# EAGLE design hello_world (EAGLE 6.5.0)
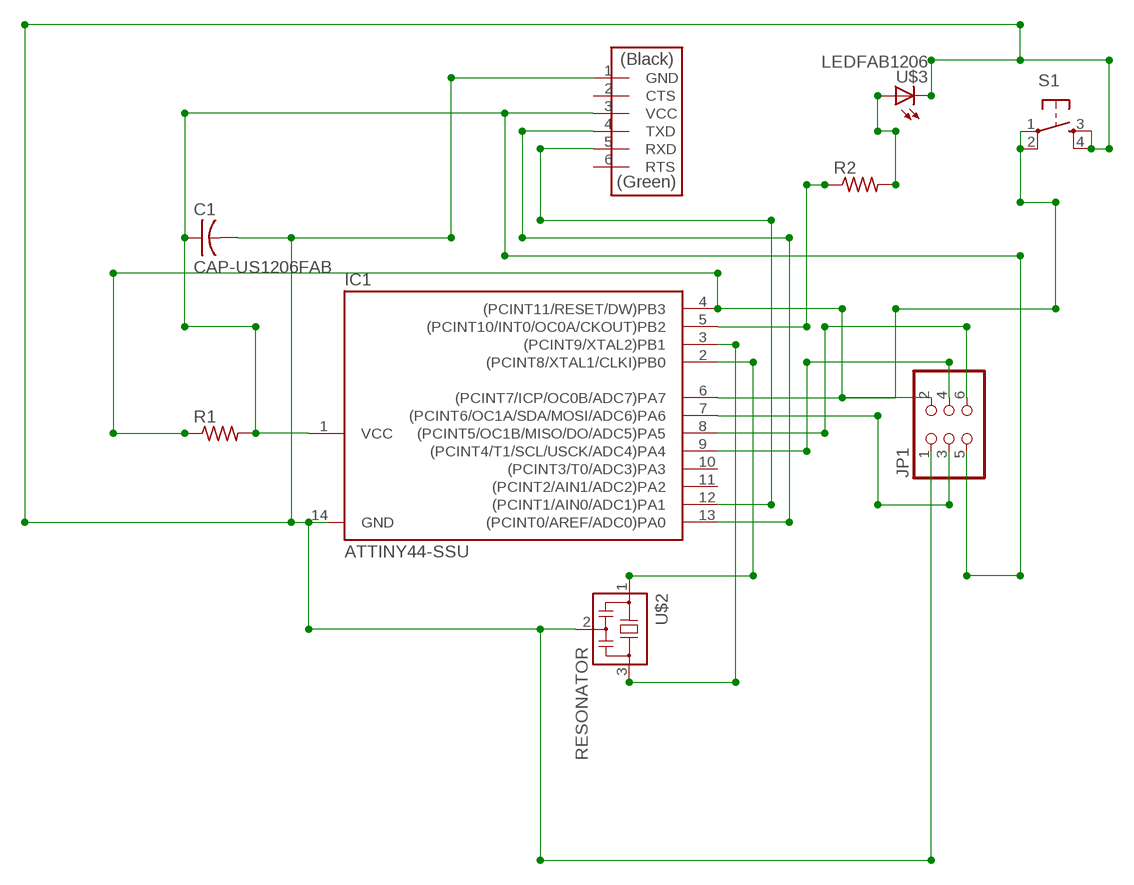
[diagram p0: schematic, sheet 1]

## Parts
C1  CAP-US1206FAB  [C1206FAB]
IC1  ATTINY44-SSU  [SOIC14]
JP1  PINHD-2X3-SMD  [2X03SMD]
R1  RES-US1206FAB  [R1206FAB]
R2  RES-US1206FAB  [R1206FAB]
S1  6MM_SWITCH6MM_SWITCH  [6MM_SWITCH]
U$1  FTDI-SMD-HEADER  [1X06SMD]
U$2  RESONATOR  [EFOBM]
U$3  LEDFAB1206  [LED1206FAB]

## Nets
N$1: C1.1 IC1.1(VCC) IC1.13((PCINT0/AREF/ADC0)PA0) JP1.5 R1.2 U$1.3(VCC) U$1.4(TXD)
N$2: IC1.9((PCINT4/T1/SCL/USCK/ADC4)PA4) JP1.4
N$3: IC1.7((PCINT6/OC1A/SDA/MOSI/ADC6)PA6) JP1.3
N$4: IC1.4((PCINT11/RESET/DW)PB3) JP1.2 R1.1
N$5: IC1.12((PCINT1/AIN0/ADC1)PA1) U$1.5(RXD)
N$6: IC1.2((PCINT8/XTAL1/CLKI)PB0) U$2.1
N$7: IC1.3((PCINT9/XTAL2)PB1) U$2.3
N$8: C1.2 IC1.14(GND) JP1.1 U$1.1(GND) U$2.2
N$9: IC1.8((PCINT5/OC1B/MISO/DO/ADC5)PA5) JP1.6
N$10: IC1.5((PCINT10/INT0/OC0A/CKOUT)PB2) R2.1
N$11: IC1.6((PCINT7/ICP/OC0B/ADC7)PA7) S1.1(P) S1.2(P1)
N$12: R2.2 U$3.1(A)
N$13: S1.3(S) S1.4(S1) U$3.2(C)
Unconnected: IC1.10((PCINT3/T0/ADC3)PA3) IC1.11((PCINT2/AIN1/ADC2)PA2) U$1.2(CTS) U$1.6(RTS)

## Library data of the parts
C1 = fab:CAP-US
IC1 = fab:ATTINY44
JP1 = fab:PINHD-2X3-SMD: PIN HEADER
R1 R2 = fab:RES-US: Resistor (US Symbol) Variants with postfix FAB are widened to allow the routing of internal traces
S1 = fab:6MM_SWITCH: OMRON SWITCH
U$1 = fab:FTDI-SMD-HEADER
U$2 = fab:RESONATOR
U$3 = fab:LED: LED

## Net classes
0 default: clearance 0.205 mm

## Board
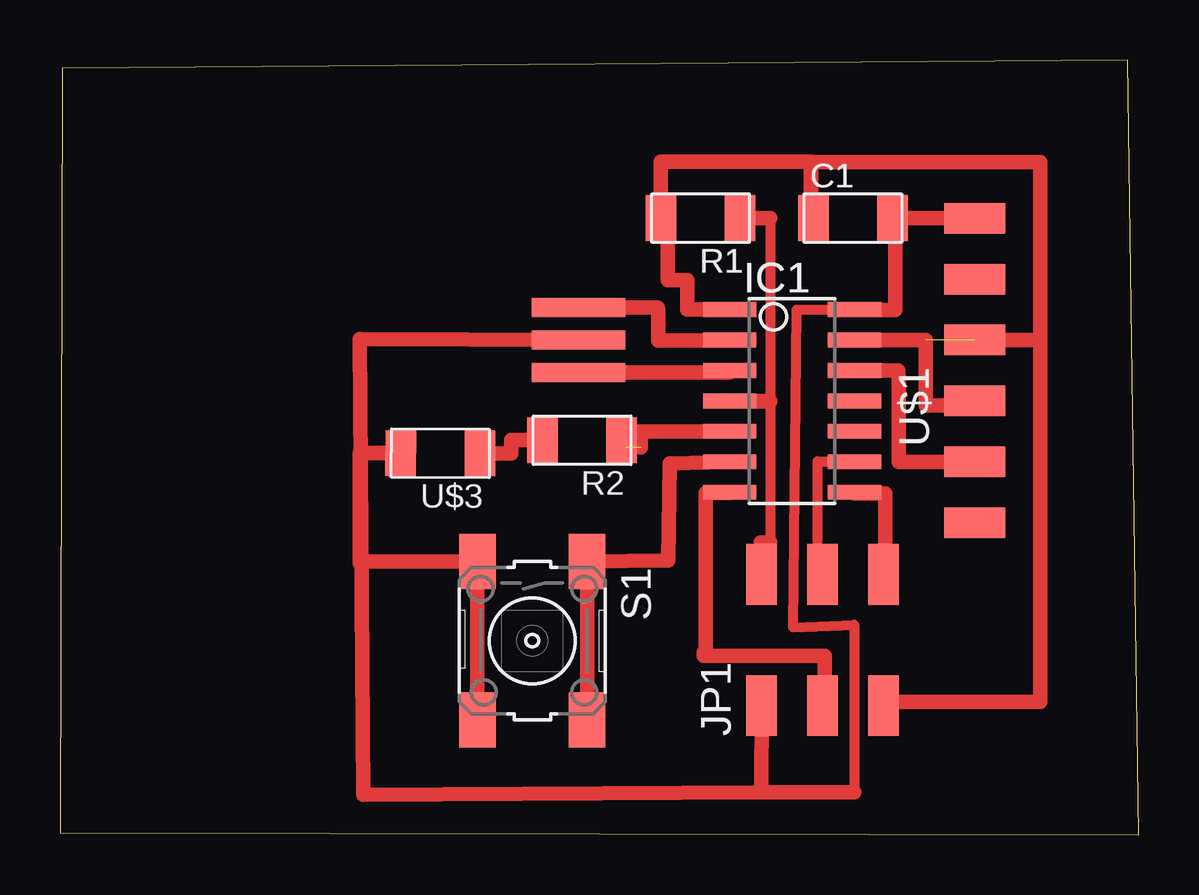
[diagram p1: board, top side]

Size 44.95 x 32.3 mm. Coordinates in mm from the lower left corner, seen from the top.
Outline: 0,0.08 44.95,0 44.48,32.3 0.1,31.95 0,0.08
Copper layers (1*16): Top 0.035mm / dielectric 1.5mm / Bottom 0.035mm
Design rules "Hello World Schemadic": minimum track width 10mil, minimum drill 24mil, track to track 0.205mm, track to pad 0.205mm, pad to pad 0.205mm, via to via 0.205mm, smd to smd 8mil, copper to edge 40mil, drill to drill 8mil, minimum pad ring 10mil, minimum via ring 8mil, stop-mask expansion 4mil, vias tented up to drill 0mil, thermal gap 10mil

### Footprints (pad centres in the part's own frame; a part is rotated, then mirrored left to right if it is on the bottom)
C1206FAB = smd 1.27 x 1.905: 1 -1.651,0; 2 1.651,0
SOIC14 = smd 0.61 x 2.21: 1 -3.81,-2.603; 2 -2.54,-2.603; 3 -1.27,-2.603; 4 0,-2.603; 5 1.27,-2.603; 6 2.54,-2.603; 7 3.81,-2.603; 8 3.81,2.603; 9 2.54,2.603; 10 1.27,2.603; 11 0,2.603; 12 -1.27,2.603; 13 -2.54,2.603; 14 -3.81,2.603
2X03SMD = smd 2.54 x 1.27: 1 -2.54,2.54; 2 2.92,2.54; 3 -2.54,0; 4 2.92,0; 5 -2.54,-2.54; 6 2.92,-2.54
R1206FAB = smd 1.27 x 1.905: 1 -1.651,0; 2 1.651,0
6MM_SWITCH = smd 2.286 x 1.524: 1 -3.302,2.286; 2 3.302,2.286; 3 -3.302,-2.286; 4 3.302,-2.286
1X06SMD = smd 2.54 x 1.27: 1 0,6.35; 2 0,3.81; 3 0,1.27; 4 0,-1.27; 5 0,-3.81; 6 0,-6.35
EFOBM = smd 0.8 x 3.9: 1 -1.35,0; 2 0,0; 3 1.35,0
LED1206FAB = smd 1.27 x 1.905: 1 -1.651,0; 2 1.651,0

### Placement (x,y rotation side)
C1  33.04,25.7 0 top
IC1  30.5,18.08 270 top
JP1  31.77,7.92 90 top
R1  26.69,25.7 180 top
R2  21.75,16.45 180 top
S1  19.68,8.09 270 top
U$1  38.12,19.35 0 top
U$2  21.61,20.62 270 top
U$3  15.85,15.9 179.8 top

### Tracks (layer width: path | path; a pad name or v marks a point on that pad's centre or on a via)
N$1  (1 unrouted)
  Top 0.61: IC1.1 26.13,21.89 26.13,23.11 25.32,23.11 25.32,25.7 R1.2 25.04,28.06 31.3,28.06 31.3,25.7 C1.1 31.28,25.7 31.28,28.04 40.84,28.04 40.84,20.61 | U$1.3 40.84,20.61 | 40.84,20.61 40.84,5.54 34.31,5.54 JP1.5 | IC1.13 36.07,20.62 36.07,17.89 38.12,17.89 U$1.4
N$2
  Top 0.406: JP1.4 31.57,10.84 31.57,15.56 33.1,15.56 IC1.9
N$3
  Top 0.61: JP1.3 31.86,5.38 31.86,7.46 26.82,7.46 26.82,7.59 26.9,7.59 26.9,14.24 27.9,14.24 IC1.7
N$4
  Top 0.406: 29.58,25.7 29.58,18.08 29.58,12.19
  Top 0.61: R1.1 29.58,25.7 | 29.58,18.06 27.9,18.06 IC1.4 29.58,18.08 | 29.58,12.19 29.23,12.19 | 29.2,12.19 29.23,12.19 | 29.23,12.19 JP1.2
N$5
  Top 0.61: IC1.12 34.92,19.35 34.92,19.1 34.95,19.1 34.95,15.53 U$1.5
N$6
  Top 0.61: U$2.1 24.91,21.97 24.91,21.89 24.93,21.89 24.93,20.59 27.9,20.59 IC1.2
N$7
  Top 0.61: U$2.3 27.9,19.27 IC1.3
N$8
  Top 0.406: 33.1,21.86 30.68,21.88 30.54,8.64 33.09,8.75 33.09,1.77
  Top 0.61: U$1.1 C1.2 34.81,25.7 34.81,21.86 33.1,21.86 IC1.14 | JP1.1 29.23,1.77 | 29.23,1.77 12.63,1.66 12.49,20.67 U$2.2 | 33.09,1.77 29.23,1.77
N$9
  Top 0.61: JP1.6 34.39,10.84 34.39,14.23 33.1,14.23 IC1.8
N$10  (1 unrouted)
  Top 0.61: 23.57,15.9 23.57,16.8 IC1.5 | R2.1 24.2,16.45 24.2,16.14
N$11
  Top 0.61: S1.2 S1.1 25.35,11.44 25.4,15.47 IC1.6
N$12
  Top 0.61: U$3.1 18.81,15.9 18.81,16.45 R2.2 | R2.2
N$13
  Top 0.61: S1.4 S1.3 12.52,11.39 12.52,11.32 12.48,11.32 12.48,15.91 U$3.2

### Text on the board
_tNames: C1 | R1 | IC1 | U$1 | JP1